# EAGLE design roach-fem (EAGLE 7.6.0)
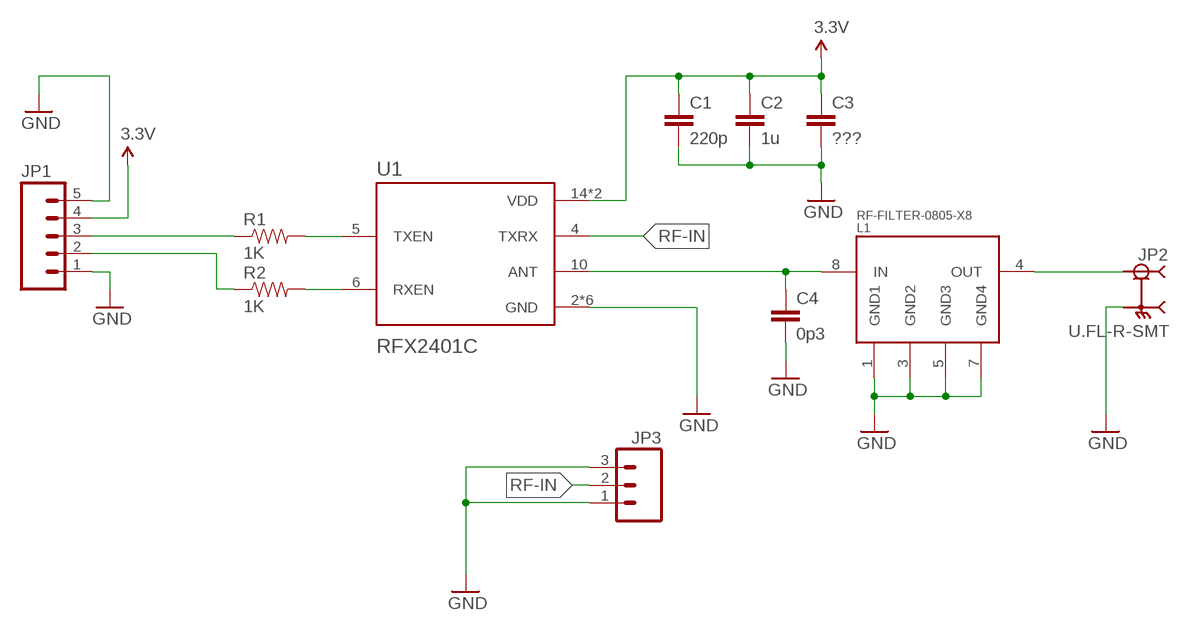
[diagram p0: schematic, sheet 1]

## Parts
C1  220p  CAP0603-CAP  [0603-CAP]
C2  1u  CAP0603-CAP  [0603-CAP]
C3  ???  CAP0603-CAP  [0603-CAP]
C4  0p3  CAP0402-CAP  [0402-CAP]
JP1  M05PTH  [1X05]
JP2  U.FL-R-SMT  U.FL-R-SMT(10)  [HRS_U.FL-R-SMT(10)]
JP3  M03PTH  [1X03]
L1  RF-FILTER-0805-X8  [RF-FILTER-0805]
R1  1K  RESISTOR0603-RES  [0603-RES]
R2  1K  RESISTOR0603-RES  [0603-RES]
U1  RFX2401C  [QFN50P300X300X60-17N]

## Nets
3.3V: C1.1 C2.1 C3.1 JP1.4 U1.14(VDD) U1.16(VDD)
GND: C1.2 C2.2 C3.2 C4.2 JP1.1 JP1.5 JP2.2(GND) JP2.3(GND) JP3.1 JP3.3 L1.1(GND1) L1.3(GND2) L1.5(GND3) L1.7(GND4) U1.2(GND) U1.3(GND) U1.8(GND) U1.9(GND) U1.11(GND) U1.17(GND)
N$1: JP1.3 R1.1
N$2: JP1.2 R2.1
N$3: R1.2 U1.5(TXEN)
N$4: R2.2 U1.6(RXEN)
N$6: C4.1 L1.8(IN) U1.10(ANT)
N$7: JP2.1(SIG) L1.4(OUT)
RF-IN: JP3.2 U1.4(TXRX)

## Library data of the parts
C1-C4 = roach-fem:CAP: Capacitor Standard 0603 ceramic capacitor, and 0.1" leaded capacitor.
JP1 = roach-fem:M05: Header 5 Standard 5-pin 0.1" header. Use with straight break away headers (SKU : PRT-00116), right angle break away headers (PRT-00553), swiss pins (PRT-00743), machine pins (PRT-00117), and female headers (PRT-00115). Molex polarized connector foot print use with SKU : PRT-08230 with associated crimp pins and housings.
JP2 = roach-fem:U.FL-R-SMT(10): U.FL Series 50 Ohm Receptacle Male Pins Ultra Small SMT Coaxial Connector Check availability <https://pricing.snapeda.com/parts/U.FL-R-SMT%2810%29/Hirose%20Electric%20Co%20Ltd/view-part?ref=eda>; AVAILABILITY: In Stock; DESCRIPTION: U.FL (UMCC) Connector Receptacle, Male Pin 50Ohm Surface Mount Solder; MF: Hirose Electric Co Ltd; MP: U.FL-R-SMT(10); PACKAGE: None; PRICE: None; PURCHASE-URL: https://pricing.snapeda.com/search/part/U.FL-R-SMT(10)/?ref=eda
JP3 = roach-fem:M03: Header 3 Standard 3-pin 0.1" header. Use with straight break away headers (SKU : PRT-00116), right angle break away headers (PRT-00553), swiss pins (PRT-00743), machine pins (PRT-00117), and female headers (PRT-00115). Molex polarized connector foot print use with SKU : PRT-08232 with associated crimp pins and housings.
L1 = roach-fem:RF-FILTER
R1 R2 = roach-fem:RESISTOR: Resistor Basic schematic elements and footprints for 0603, 1206, and PTH resistors.
U1 = roach-fem:RFX2401C: None Check availability <https://pricing.snapeda.com/parts/RFX2401C/Skyworks%20Solutions/view-part?ref=eda>; AVAILABILITY: In Stock; DESCRIPTION: RF Front End 2.4GHz ~ 2.5GHz 802.15.4, Zigbee® 16-QFN (3x3); MF: Skyworks Solutions; MP: RFX2401C; PACKAGE: UFQFN-16 Skyworks Solutions; PRICE: None; PURCHASE-URL: https://pricing.snapeda.com/search/part/RFX2401C/?ref=eda

## Board
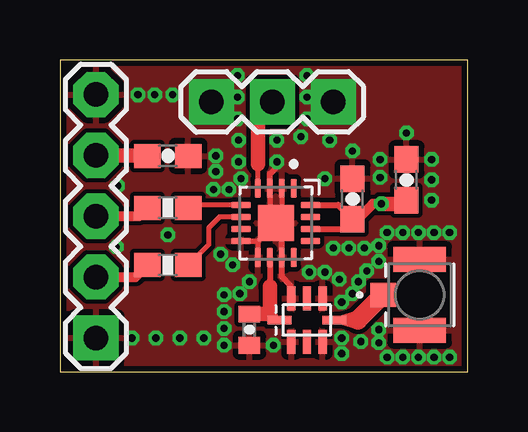
[diagram p1: board, top side]
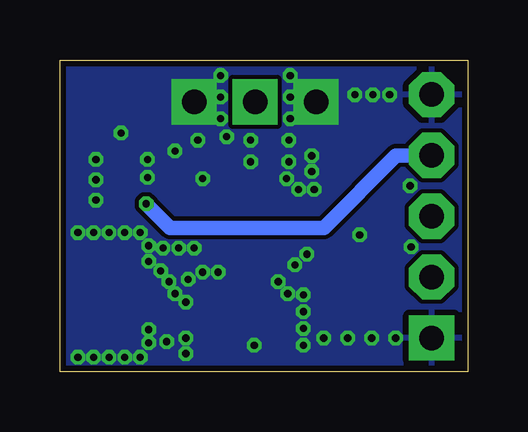
[diagram p2: board, bottom side, seen from below]

Size 17 x 13 mm. Coordinates in mm from the lower left corner, seen from the top.
Outline: 0,0 17,0 17,13 0,13 0,0
Copper layers (1*16): Top 0.035mm / dielectric 1.5mm / Bottom 0.035mm
Design rules "Fusion_eagle_rule_v1.1_TentedVias3": minimum track width 6mil, minimum drill 0.3mm, track to track 7mil, track to pad 7mil, pad to pad 7mil, via to via 7mil, smd to smd 0mil, copper to edge 10mil, drill to drill 10mil, minimum pad ring 10mil, minimum via ring 6mil, stop-mask expansion 2mil, vias tented up to drill 25mil, thermal gap 10mil
tRestrict: 1 lines

### Footprints (pad centres in the part's own frame; a part is rotated, then mirrored left to right if it is on the bottom)
0603-CAP = smd 1.1 x 1: 1 -0.85,0; 2 0.85,0
0402-CAP = smd 0.7 x 0.9: 1 -0.65,0; 2 0.65,0
1X05 = drill 1.016 pad 1.88 square: 1 0,0 | drill 1.016 pad 1.88 octagon: 2 2.54,0; 3 5.08,0; 4 7.62,0; 5 10.16,0
HRS_U.FL-R-SMT(10) = smd 1.05 x 1: 1 -1.525,0 | smd 2.2 x 1.05: 2 0,1.475; 3 0,-1.475
1X03 = drill 1.016 pad 1.88 square: 1 0,0; 2 2.54,0; 3 5.08,0
RF-FILTER-0805 = smd 0.35 x 1: 1 -0.65,-0.9; 2 0,-0.9; 3 0.65,-0.9; 5 0.65,0.9; 6 0,0.9; 7 -0.65,0.9 | smd 1 x 0.35: 4 1.15,0; 8 -1.15,0
0603-RES = smd 1.1 x 1: 1 -0.85,0; 2 0.85,0
QFN50P300X300X60-17N = smd 0.81 x 0.27: 1 -1.445,0.75; 2 -1.445,0.25; 3 -1.445,-0.25; 4 -1.445,-0.75; 9 1.445,-0.75; 10 1.445,-0.25; 11 1.445,0.25; 12 1.445,0.75 | smd 0.27 x 0.81: 5 -0.75,-1.445; 6 -0.25,-1.445; 7 0.25,-1.445; 8 0.75,-1.445; 13 0.75,1.445; 14 0.25,1.445; 15 -0.25,1.445; 16 -0.75,1.445 | smd 1.5 x 1.5: 17 0,0

### Placement (x,y rotation side)
C1  12.2,7.2 90 top
C2  14.45,8 90 top
C3  4.5,9 0 top
C4  7.9,1.75 270 top
JP1  1.5,1.4 90 top
JP2  15,3.2 0 top
JP3  11.4,11.25 180 top
L1  10.3,2.15 0 top
R1  4.5,6.83 0 top
R2  4.5,4.44 0 top
U1  9,6.2 270 top

### Tracks (layer width: path | path; a pad name or v marks a point on that pad's centre or on a via)
3.3V  (via drill 0.3)
  Top 0.254: U1.14 12.2,5.95 C1.1 11.6,6.95 U1.16
  Top 0.406: v13.4,7 13.05,7 12.4,6.35 C1.1
  Top 0.61: C3.1 3.65,9.02 JP1.4 | C2.1 14.45,7 v13.4,7
  Bottom 0.61: JP1.4 2.98,9.02 6,6 12.4,6 v13.4,7
GND  (via drill 0.3)
  Top 0.203: 8.75,7.6 8.75,6.7 | 9.25,7.55 9.25,6.75 | U1.8 8.25,5.45 | 8.25,5.45 8.25,5 | 8.25,5.45 8.4,5.6
  Top 0.254: U1.11 9.25,5.95 U1.17 | 8.75,7.6 8.75,8.25 9.05,8.55 v9.05,8.75 | 9.65,3.3 9.6,3.35 9.6,3.6 9.25,3.95 9.25,4.6
  other vias: 7.45,9.65 7.45,8.75 7.55,8.05 9.05,9.65 6.7,4.9 10.4,4.15 11.05,4.15 11.75,2.9 11.75,1.4 12.45,3.75 12.8,4.2 13.3,1.2 13.3,4.6 13.3,5.25 13.65,5.8 14.95,5.8 14.3,5.8 15.6,5.8 13.65,0.6 14.3,0.6 14.95,0.6 15.6,0.6 16.25,0.6 16.25,5.8 11.75,0.75 11.65,3.85 13.35,8.85 14.45,9.95 15.5,8.85 4.5,5.7 2.35,5.2 2.4,7.75 12.2,9.2 11.05,8.05 13.35,8.1 3.25,11.55 3.95,11.55 3,1.4 4,1.4 5,1.4 6,1.4 4.7,11.55 11.25,9.65 6.4,7.6 7.05,7.6 7.2,4.45 11.4,5.15 12.05,5.15 12.7,5.15 8.9,1.1 6.85,1.1 6.85,1.8 6.85,2.5 6.85,3.2 7.5,3.25 7.9,3.75 6.5,9 6.5,8.35 15.5,8 15.5,7.15 7.4,10.55 7.4,11.45 7.4,12.35 10.3,10.55 10.05,9.8 10.3,11.45 10.3,12.35 13.3,1.75 12.55,1.25 12.2,3.25
  pour Bottom: 0,0 17,0 17,13 0,13
  pour Top: 0,0 17,0 17,13 0,13
N$1
  Top 0.406: JP1.3 3.3,6.48 R1.1
N$2
  Top 0.406: JP1.2 3.15,3.94 R2.1
N$3
  Top 0.203: U1.5 5.47,6.95
  Top 0.254: 5.47,6.95 R1.2
N$4
  Top 0.203: U1.6 6.65,6.45 6.2,6 6.2,5.29 R2.2
N$6
  Top 0.254: U1.10 8.75,3.55 | L1.8 8.95,2.15 8.95,2.35 8.9,2.4 8.75,2.4
  Top 0.61: 8.75,3.55 8.75,2.4 C4.1
N$7
  Top 0.254: 12.35,1.9 11.5,2.15 12.9,2.6
  Top 0.35: L1.4 11.5,2.15 12.43,2.15
  Top 0.813: 12.43,2.15 JP2.1
RF-IN
  Top 0.203: U1.4 8.25,8.65
  Top 0.61: 8.25,8.65 8.25,11.25 JP3.2